# Altium schematic sheet AnalogSigCond2.SchDoc: Analog Signal Front-End 2
size Letter; Engineer: Nathan Petersen; DocumentNumber: 16; Revision: v1.2; SheetNumber: 16; SheetTotal: 30
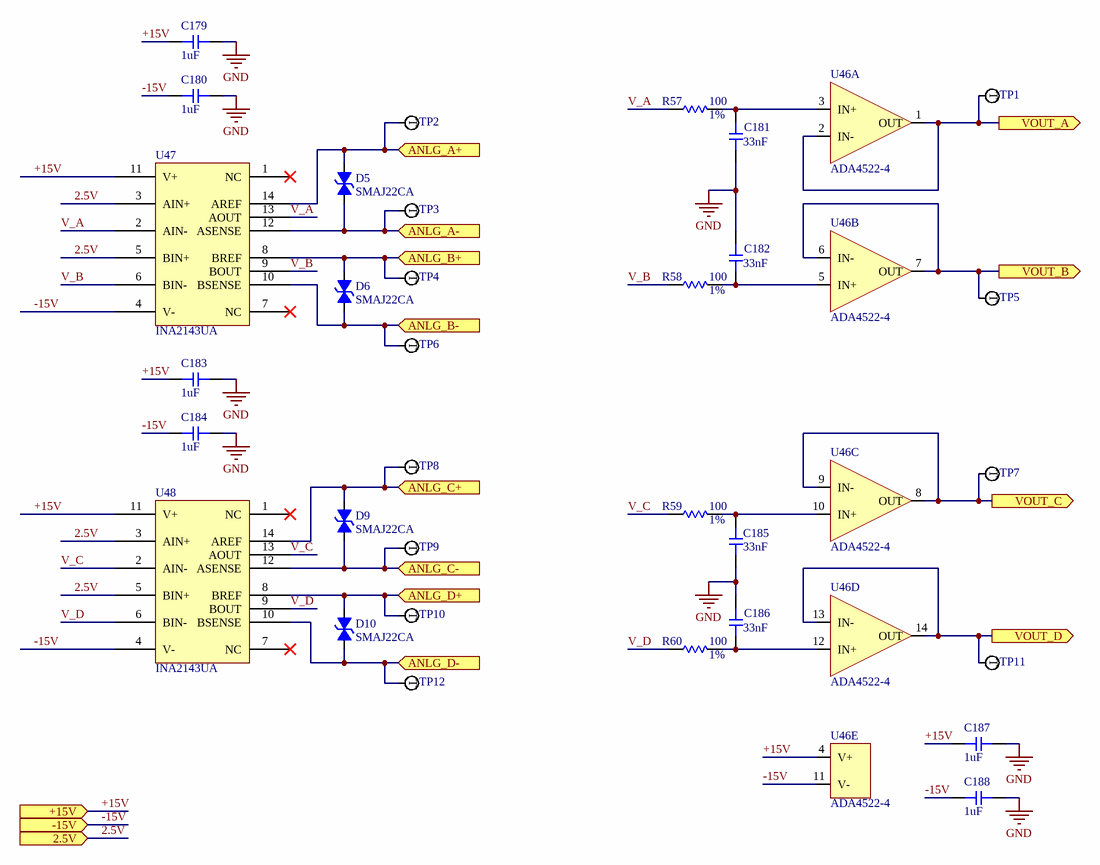
[diagram p0: AnalogSigCond2.SchDoc]

## Parts
C179  value 1uF  [0603-CAP]  (hidden comment: Capacitor)
C180  value 1uF  [0603-CAP]  (hidden comment: Capacitor)
C181  Capacitance: 33nF  [0603-CAP]  (hidden comment: Capacitor)
C182  Capacitance: 33nF  [0603-CAP]  (hidden comment: Capacitor)
C183  value 1uF  [0603-CAP]  (hidden comment: Capacitor)
C184  value 1uF  [0603-CAP]  (hidden comment: Capacitor)
C185  Capacitance: 33nF  [0603-CAP]  (hidden comment: Capacitor)
C186  Capacitance: 33nF  [0603-CAP]  (hidden comment: Capacitor)
C187  value 1uF  [0603-CAP]  (hidden comment: Capacitor)
C188  value 1uF  [0603-CAP]  (hidden comment: Capacitor)
D5  Manufacturer Part Number: SMAJ22CA  [SMA]  (hidden comment: TVS SMAJ22CA)
D6  Manufacturer Part Number: SMAJ22CA  [SMA]  (hidden comment: TVS SMAJ22CA)
D9  Manufacturer Part Number: SMAJ22CA  [SMA]  (hidden comment: TVS SMAJ22CA)
D10  Manufacturer Part Number: SMAJ22CA  [SMA]  (hidden comment: TVS SMAJ22CA)
R57  Resistance: 100  Tolerance: 1%  [0603-RES]  (hidden comment: Resistor)
R58  Resistance: 100  Tolerance: 1%  [0603-RES]  (hidden comment: Resistor)
R59  Resistance: 100  Tolerance: 1%  [0603-RES]  (hidden comment: Resistor)
R60  Resistance: 100  Tolerance: 1%  [0603-RES]  (hidden comment: Resistor)
TP1  Test Point  [RCU-0C]  (value not drawn)
TP2  Test Point  [RCU-0C]  (value not drawn)
TP3  Test Point  [RCU-0C]  (value not drawn)
TP4  Test Point  [RCU-0C]  (value not drawn)
TP5  Test Point  [RCU-0C]  (value not drawn)
TP6  Test Point  [RCU-0C]  (value not drawn)
TP7  Test Point  [RCU-0C]  (value not drawn)
TP8  Test Point  [RCU-0C]  (value not drawn)
TP9  Test Point  [RCU-0C]  (value not drawn)
TP10  Test Point  [RCU-0C]  (value not drawn)
TP11  Test Point  [RCU-0C]  (value not drawn)
TP12  Test Point  [RCU-0C]  (value not drawn)
U46  ADA4522-4  [TSSOP-14]  (parts A,B,C,D,E of 5)
U47  INA2143UA  [SOIC14_N]
U48  INA2143UA  [SOIC14_N]

## Ports
2.5V (in), +15V (in), -15V (in), ANLG_A+ (in), ANLG_A- (in), ANLG_B+ (in), ANLG_B- (in), ANLG_C+ (in), ANLG_C- (in), ANLG_D+ (in), ANLG_D- (in), VOUT_A (out), VOUT_B (out), VOUT_C (out), VOUT_D (out)

## Nets
GND: C179.2 C180.2 C181.1 C182.2 C183.2 C184.2 C185.1 C186.2 C187.2 C188.2
2.5V: U47.3(AIN+) U47.5(BIN+) U48.3(AIN+) U48.5(BIN+) ; port 2.5V
+15V: C179.1 C183.1 C187.1 U46.4(V+) U47.11(V+) U48.11(V+) ; port +15V
-15V: C180.1 C184.1 C188.1 U46.11(V-) U47.4(V-) U48.4(V-) ; port -15V
ANLG_A+: D5.2 TP2.1 U47.14(AREF) ; port ANLG_A+
ANLG_A-: D5.1 TP3.1 U47.12(ASENSE) ; port ANLG_A-
ANLG_B+: D6.2 TP4.1 U47.8(BREF) ; port ANLG_B+
ANLG_B-: D6.1 TP6.1 U47.10(BSENSE) ; port ANLG_B-
ANLG_C+: D9.2 TP8.1 U48.14(AREF) ; port ANLG_C+
ANLG_C-: D9.1 TP9.1 U48.12(ASENSE) ; port ANLG_C-
ANLG_D+: D10.2 TP10.1 U48.8(BREF) ; port ANLG_D+
ANLG_D-: D10.1 TP12.1 U48.10(BSENSE) ; port ANLG_D-
V_A: R57.1 U47.2(AIN-) U47.13(AOUT)
V_B: R58.1 U47.6(BIN-) U47.9(BOUT)
V_C: R59.1 U48.2(AIN-) U48.13(AOUT)
V_D: R60.1 U48.6(BIN-) U48.9(BOUT)
VOUT_A: TP1.1 U46.1(OUT) U46.2(IN-) ; port VOUT_A
VOUT_B: TP5.1 U46.6(IN-) U46.7(OUT) ; port VOUT_B
VOUT_C: TP7.1 U46.8(OUT) U46.9(IN-) ; port VOUT_C
VOUT_D: TP11.1 U46.13(IN-) U46.14(OUT) ; port VOUT_D
NetC181_2: C181.2 R57.2 U46.3(IN+)
NetC182_1: C182.1 R58.2 U46.5(IN+)
NetC185_2: C185.2 R59.2 U46.10(IN+)
NetC186_1: C186.1 R60.2 U46.12(IN+)

Not connected (* = marked no-connect by the designer): U47 1(NC)* 7(NC)*; U48 1(NC)* 7(NC)*

## Notes on the sheet
- Title:
- File:
- Sheet:
- of
- Revision:
- Time:
- Date:
- Engineer:
- (in symbol Test Point) T

## Library data of the parts
C179 C180 C183 C184 C187 C188 = Capacitor: Manufacturer: Samsung; Manufacturer Part Number: CL10B105MO8NNWC; Voltage Rating: 16V; Tolerance: 20%; Supplier 1: Digi-Key; Supplier Part Number 1: 1276-6524-6-ND; Stock 1: 40000; Pricing 1: 1=0.1, 10=0.032, 100=0.0142, 500=0.01016, 1000=0.00798 (USD); Mount: Surface Mount; Case/Package: 0603; Case Code (Metric): 1608; Case Code (Imperial): 0603; Min Operating Temperature: -55°C; Max Operating Temperature: 125°C; Packaging: Tape and Reel; Capacitance: 1uF; Length: 0.063inch; Width: 0.031inch; Thickness: 0.035inch; ComponentLink1URL: http://www.samsungsem.com/kr/support/product-search/mlcc/CL10B105MO8NNWC.jsp; ComponentLink1Description: http://www.samsungsem.com/kr/support/product-search/mlcc/CL10B105MO8NNWC.jsp
C181 C182 C185 C186 = Capacitor: Manufacturer: Kyocera AVX; Manufacturer Part Number: 12065C333KAT2A; Dielectric Material: Ceramic; Tolerance: 10%; Voltage Rating: 50V; Dielectric: X7R; Dissipation Factor: 2.5%; Supplier 1: Digi-Key; Supplier Part Number 1: 478-1548-6-ND; Stock 1: 21; Pricing 1: 1=0.36, 10=0.25, 100=0.1417, 500=0.10006, 1000=0.08754 (USD); Mount: Surface Mount; Case/Package: 1206; Number of Pins: 2; Case Code (Metric): 3216; Case Code (Imperial): 1206; Contact Plating: Tin,Matte; Min Operating Temperature: -55°C; Max Operating Temperature: 125°C; Voltage Rating (DC): 50V; Packaging: Tape and Reel; Package Quantity: 1; Termination: SMD/SMT; Voltage: 50V; Length: 3.2mm; Height: 0.94mm; Width: 1.6mm; Thickness: 0.037inch; Depth: 1.6mm; REACH SVHC: Unknown; Lead Free: Lead Free; ComponentLink1URL: https://datasheet.ciiva.com/25613/0900766b802d4697-25613091.pdf; ComponentLink1Description: https://datasheet.ciiva.com/25613/0900766b802d4697-25613091.pdf; ComponentLink2URL: https://datasheet.ciiva.com/151/cx7r-151861.pdf; ComponentLink2Description: https://datasheet.ciiva.com/151/cx7r-151861.pdf; ComponentLink3URL: https://datasheet.ciiva.com/7833/cx7r-7833445.pdf; ComponentLink3Description: https://datasheet.ciiva.com/7833/cx7r-7833445.pdf; ComponentLink4URL: https://datasheet.ciiva.com/16543/cx7r-16543717.pdf; ComponentLink4Description: https://datasheet.ciiva.com/16543/cx7r-16543717.pdf; ComponentLink5URL: https://datasheet.ciiva.com/151/cx7r-151862.pdf; ComponentLink5Description: https://datasheet.ciiva.com/151/cx7r-151862.pdf; ComponentLink6URL: https://datasheet.ciiva.com/151/cx7r-151863.pdf; ComponentLink6Description: https://datasheet.ciiva.com/151/cx7r-151863.pdf; ComponentLink7URL: https://datasheet.ciiva.com/11787/0900766b802d4698-11787159.pdf; ComponentLink7Description: https://datasheet.ciiva.com/11787/0900766b802d4698-11787159.pdf; ComponentLink8URL: https://datasheet.ciiva.com/5412/cx7r-218113-5412600.pdf; ComponentLink8Description: https://datasheet.ciiva.com/5412/cx7r-218113-5412600.pdf; ComponentLink9URL: https://datasheet.ciiva.com/19475/740527-19475934.pdf; ComponentLink9Description: https://datasheet.ciiva.com/19475/740527-19475934.pdf; ComponentLink10URL: https://datasheet.ciiva.com/2988/cx7r-2988143.pdf; ComponentLink10Description: https://datasheet.ciiva.com/2988/cx7r-2988143.pdf; ComponentLink11URL: https://datasheet.ciiva.com/11521/cx7r-11521055.pdf; ComponentLink11Description: https://datasheet.ciiva.com/11521/cx7r-11521055.pdf
D5 D6 D9 D10 = TVS SMAJ22CA: TVS DIODE 22V 35.5V SMA; Manufacturer: Bourns; Direction: Bidirectional; Reverse Breakdown Voltage: 24.4V; Operating Supply Voltage: 3.5V; Max Surge Current: 40A; Number of Bidirectional Channels: 1; Peak Pulse Power: 400W; Power Line Protection: No; Breakdown Voltage: 26.9V; Peak Pulse Current: 11.2A; Test Current: 1mA; Max Reverse Leakage Current: 5uA; Element Configuration: Single; ComponentLink1URL: https://datasheet.ciiva.com/333/smaj-333520.pdf; ComponentLink1Description: https://datasheet.ciiva.com/333/smaj-333520.pdf; ComponentLink2URL: https://datasheet.ciiva.com/3022/smaj-3022225.pdf; ComponentLink2Description: https://datasheet.ciiva.com/3022/smaj-3022225.pdf; ComponentLink3URL: https://datasheet.ciiva.com/17413/smaj-17413512.pdf; ComponentLink3Description: https://datasheet.ciiva.com/17413/smaj-17413512.pdf; ComponentLink4URL: https://datasheet.ciiva.com/4509/smaj-74970-4509930.pdf; ComponentLink4Description: https://datasheet.ciiva.com/4509/smaj-74970-4509930.pdf; ComponentLink5URL: https://datasheet.ciiva.com/333/smaj-333518.pdf; ComponentLink5Description: https://datasheet.ciiva.com/333/smaj-333518.pdf; ComponentLink6URL: https://datasheet.ciiva.com/333/smaj-333519.pdf; ComponentLink6Description: https://datasheet.ciiva.com/333/smaj-333519.pdf; Supplier 1: Digi-Key; Stock 1: 24429; Pricing 1: 1=0.45, 10=0.353, 25=0.2976, 100=0.2421, 250=0.2006, 500=0.16602, 1000=0.12451, 2500=0.11414 (USD); Mount: Surface Mount; Case/Package: SMA; Number of Pins: 2; Min Operating Temperature: -55°C; Max Operating Temperature: 150°C; Packaging: Tape and Reel; Package Quantity: 1; Reverse Standoff Voltage: 22V; Min Breakdown Voltage: 24.4V; Clamping Voltage: 35.5V; Number of Channels: 1; Polarity: Bidirectional; Termination: SMD/SMT; Number of Elements: 1; Leakage Current: 5uA; Composition: Zener; Radiation Hardening: No; ComponentLink7URL: https://datasheet.ciiva.com/3022/smaj-3022227.pdf; ComponentLink7Description: https://datasheet.ciiva.com/3022/smaj-3022227.pdf; ComponentLink8URL: https://datasheet.ciiva.com/3022/smaj-3022228.pdf; ComponentLink8Description: https://datasheet.ciiva.com/3022/smaj-3022228.pdf; ComponentLink9URL: https://datasheet.ciiva.com/334/smaj-334501.pdf; ComponentLink9Description: https://datasheet.ciiva.com/334/smaj-334501.pdf; ComponentLink10URL: https://datasheet.ciiva.com/334/smaj-334502.pdf; ComponentLink10Description: https://datasheet.ciiva.com/334/smaj-334502.pdf; ComponentLink11URL: https://datasheet.ciiva.com/334/smaj-334503.pdf; ComponentLink11Description: https://datasheet.ciiva.com/334/smaj-334503.pdf; Supplier Part Number 1: SMAJ22CABDKR-ND
R57-R60 = Resistor: Manufacturer: Yageo; Manufacturer Part Number: AC0603FR-07100RL; Power Rating: 100mW; Voltage Rating: 50V; Temperature Coefficient: 100ppm/°C; Supplier 1: Digi-Key; Supplier Part Number 1: YAG3561DKR-ND; Stock 1: 161909; Pricing 1: 1=0.1, 10=0.032, 100=0.0129, 1000=0.00579, 2500=0.00502 (USD); Case/Package: 0603; Weight: 7.1E-05oz; Case Code (Imperial): 0603; Case Code (Metric): 1608; Contact Plating: Tin,Matte; Min Operating Temperature: -55°C; Max Operating Temperature: 155°C; Packaging: Tape and Reel; Composition: Thick Film; Number of Terminations: 2; Termination: SMD/SMT; Military Standard: Not; Max Power Dissipation: 100mW; Length: 1.6mm; Height: 0.022inch; Width: 0.031inch; Depth: 0.8mm; Radiation Hardening: No; Lead Free: Lead Free; ComponentLink1URL: https://datasheet.ciiva.com/12576/pyu-ac-51-rohs-l-2-12576586.pdf; ComponentLink1Description: https://datasheet.ciiva.com/12576/pyu-ac-51-rohs-l-2-12576586.pdf
TP1-TP12 = Test Point: Material - Insulation: No Insulation; Supplier Part Number: *; Supplier: *; Footprint: *; Supplier 1: Digi-Key; RoHS: RoHS Compliant; Category: Test and Measurement; Stock 1: 136646; Pricing 1: 1=0.22, 10=0.206, 25=0.1756, 50=0.1536, 100=0.1426, 250=0.12616, 500=0.12068, 1000=0.09874 (USD); Packaging: Cut Tape (CT); Part Status: Active; Type: PC Test Point; Mounting Type: Surface Mount; Color: Natural; Size / Dimension: 0.063" x 0.031" x 0.045" (1.60mm x 0.80mm x 1.15mm); Plating: -; Material - Body: -; ComponentLink1URL: http://www.te.com/commerce/DocumentDelivery/DDEController?Action=srchrtrv&DocNm=1773266&DocType=DS&DocLang=English; ComponentLink1Description: http://www.te.com/commerce/DocumentDelivery/DDEController?Action=srchrtrv&DocNm=1773266&DocType=DS&DocLang=English; Supplier Part Number 1: A106145CT-ND
U46 = ADA4522-4: Manufacturer: Analog Devices; Manufacturer Part Number: ADA4522-4ARUZ-RL; Number of Circuits: 4; Slew Rate: 1.7V/µs; Gain Bandwidth Product: 2.7MHz; Input Bias Current: 50pA; Input Offset Voltage (Vos): 1.5uV; Operating Supply Current: 830uA; Output Current per Channel: 32mA; Max Dual Supply Voltage: 27.5V; Voltage Gain: 137dB; Common Mode Rejection Ratio: 140dB; Power Supply Rejection Ratio (PSRR): 150dB; Min Supply Voltage: 4.5V; Min Dual Supply Voltage: 2.25V; Max Supply Voltage: 55V; Supplier 1: Digi-Key; Supplier Part Number 1: ADA4522-4ARUZ-RLCT-ND; Mount: Surface Mount; Case/Package: TSSOP; Number of Pins: 14; Contact Plating: Tin,Matte; Min Operating Temperature: -40°C; Max Operating Temperature: 125°C; Packaging: Tape and Reel; Lead Free: Contains Lead; ComponentLink1URL: http://www.mouser.com/ds/2/609/ADA4522-1_4522-2_4522-4-914641.pdf; ComponentLink1Description: http://www.mouser.com/ds/2/609/ADA4522-1_4522-2_4522-4-914641.pdf; ComponentLink2URL: http://www.analog.com/media/en/technical-documentation/data-sheets/ADA4522-1_4522-2_4522-4.pdf; ComponentLink2Description: http://www.analog.com/media/en/technical-documentation/data-sheets/ADA4522-1_4522-2_4522-4.pdf; Stock 1: 1071; Pricing 1: 1=8.7, 10=7.861, 100=6.5086, 500=5.66758, 1000=4.93628 (USD)
U47 U48 = INA2143UA: IC OPAMP DIFF 150KHZ 14SOIC; Manufacturer: Texas Instruments; Nominal Supply Current: 2.4mA; Number of Channels: 2; Quiescent Current: 950uA; Min Dual Supply Voltage: 2.25V; Max Dual Supply Voltage: 18V; Dual Supply Voltage: 15V; Max Input Voltage: -1.65V; Min Input Voltage: 1.65V; Common Mode Rejection Ratio: 80dB; Slew Rate: 5V/µs; Max Supply Voltage: 36V; Min Supply Voltage: 4.5V; Input Offset Voltage (Vos): 750uV; Output Current per Channel: 32mA; Voltage Gain: 20dB; Input Resistance: 55kR; Supplier 1: Digi-Key; Supplier Part Number 1: INA2143UA-ND; Manufacturer Part Number: INA2143UA; Stock 1: 454; Pricing 1: 1=3.96, 10=3.56, 100=2.9172, 500=2.48336, 1000=2.0944 (USD); Case/Package: D; Number of Pins: 14; Weight: 0.004564oz; Min Operating Temperature: -55°C; Max Operating Temperature: 125°C; Packaging: Rail/Tube; Bandwidth: 150kHz; Number of Circuits: 2; Package Quantity: 50; -3db Bandwidth: 150kHz; Operating Supply Current: 950uA; Number of Elements: 2; Number of Amplifiers: 2; Radiation Hardening: No; REACH SVHC: No SVHC; Lead Free: Lead Free; ComponentLink1URL: https://datasheet.ciiva.com/2976/ina2143-2976160.pdf; ComponentLink1Description: https://datasheet.ciiva.com/2976/ina2143-2976160.pdf; ComponentLink2URL: https://datasheet.ciiva.com/15128/getdatasheetpartid-393488-15128930.pdf; ComponentLink2Description: https://datasheet.ciiva.com/15128/getdatasheetpartid-393488-15128930.pdf; ComponentLink3URL: https://datasheet.ciiva.com/1485/33255-1485283.pdf; ComponentLink3Description: https://datasheet.ciiva.com/1485/33255-1485283.pdf; ComponentLink4URL: https://datasheet.ciiva.com/1800/ina143-1800008.pdf; ComponentLink4Description: https://datasheet.ciiva.com/1800/ina143-1800008.pdf; ComponentLink5URL: https://datasheet.ciiva.com/26190/sbos116-26190730.pdf; ComponentLink5Description: https://datasheet.ciiva.com/26190/sbos116-26190730.pdf; ComponentLink6URL: https://datasheet.ciiva.com/26852/ina2143ua-26852117.pdf; ComponentLink6Description: https://datasheet.ciiva.com/26852/ina2143ua-26852117.pdf